# EAGLE design motherboard (EAGLE 5.08)
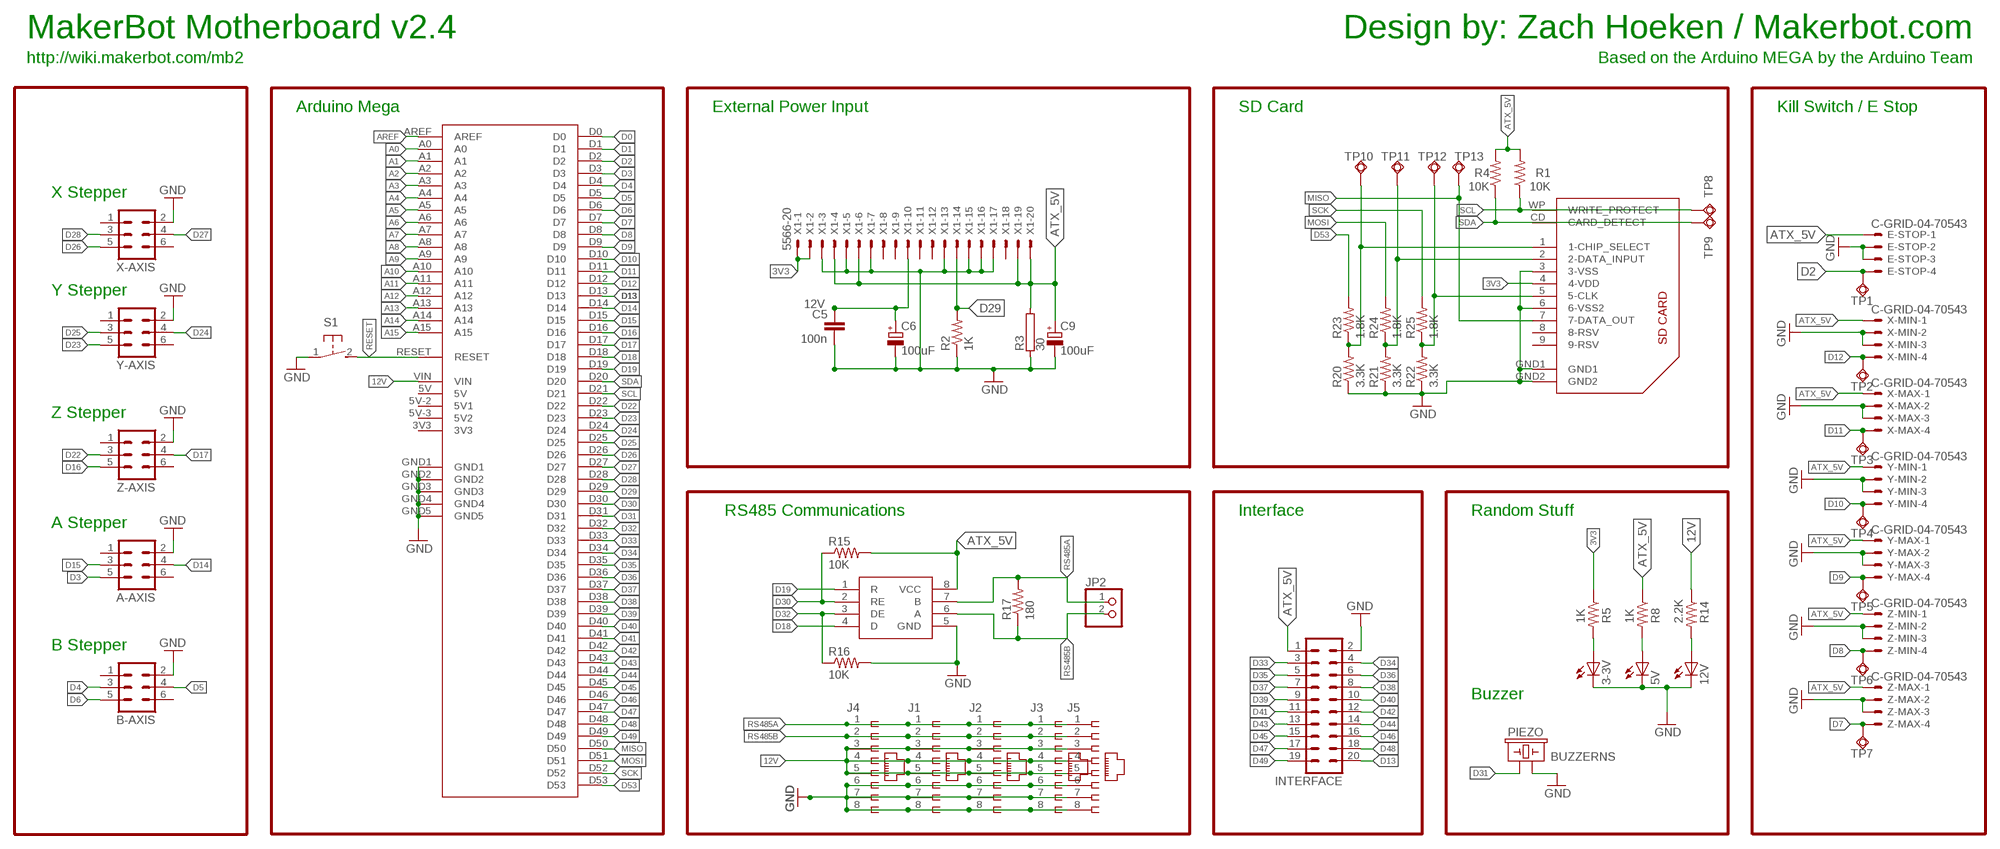
[diagram p0: schematic, sheet 1]

## Parts
3-3V  LED0805  [LED-0805]
5V  LED0805  [LED-0805]
12V  LED0805  [LED-0805]
A-AXIS  ML6  [ML6]
B-AXIS  ML6  [ML6]
C5  100n  CAP0805  [0805]
C6  100uF  CPOL-EUE3.5-8  [E3,5-8]
C9  100uF  CPOL-EUE3.5-8  [E3,5-8]
E-STOP  C-GRID-04-70543  [70543-04]
IC1  SN75176ASOIC  [SO08]
INTERFACE  ML20  [ML20]
J1  556416-1  [556416-1]
J2  556416-1  [556416-1]
J3  556416-1  [556416-1]
J4  556416-1  [556416-1]
J5  556416-1  [556416-1]
JP2  PINHD-1X2  [1X02]
PIEZO  BUZZERNS  [BUZZER-12MM-NS]
R1  10K  RESISTOR  [0805]
R2  1K  RESISTOR  [0805]
R3  30  RKH206-8  [KH206-8]
R4  10K  RESISTOR  [0805]
R5  1K  RESISTOR  [0805]
R8  1K  RESISTOR  [0805]
R14  2.2K  RESISTOR  [0805]
R15  10K  RESISTOR  [0805]
R16  10K  RESISTOR  [0805]
R17  180  RESISTOR  [0805]
R20  3.3K  RESISTOR  [0805]
R21  3.3K  RESISTOR  [0805]
R22  3.3K  RESISTOR  [0805]
R23  1.8K  RESISTOR  [0805]
R24  1.8K  RESISTOR  [0805]
R25  1.8K  RESISTOR  [0805]
S1  31-XX  [B3F-31XX]
TP1  TPSQTP09R  [TP09R]
TP2  TPSQTP09R  [TP09R]
TP3  TPSQTP09R  [TP09R]
TP4  TPSQTP09R  [TP09R]
TP5  TPSQTP09R  [TP09R]
TP6  TPSQTP09R  [TP09R]
TP7  TPSQTP09R  [TP09R]
TP8  TPSQTP09R  [TP09R]
TP9  TPSQTP09R  [TP09R]
TP10  TPSQTP09R  [TP09R]
TP11  TPSQTP09R  [TP09R]
TP12  TPSQTP09R  [TP09R]
TP13  TPSQTP09R  [TP09R]
U$1  ARDUINO-MEGA  [ARDUINO-MEGA]
U$2  SDCARD  [3M-SDCARD]
X1  5566-20  [5566-20]
X-AXIS  ML6  [ML6]
X-MAX  C-GRID-04-70543  [70543-04]
X-MIN  C-GRID-04-70543  [70543-04]
Y-AXIS  ML6  [ML6]
Y-MAX  C-GRID-04-70543  [70543-04]
Y-MIN  C-GRID-04-70543  [70543-04]
Z-AXIS  ML6  [ML6]
Z-MAX  C-GRID-04-70543  [70543-04]
Z-MIN  C-GRID-04-70543  [70543-04]

## Nets
3V3: R5.1 U$2.4(4-VDD) X1.1 X1.2
12V [power]: C5.1 C6.+ J1.3 J1.4 J1.5 J2.3 J2.4 J2.5 J3.3 J3.4 J3.5 J4.3 J4.4 J4.5 J5.3 J5.4 J5.5 R14.1 U$1.VIN X1.10
A0: U$1.A0
A1: U$1.A1
A2: U$1.A2
A3: U$1.A3
A4: U$1.A4
A5: U$1.A5
A6: U$1.A6
A7: U$1.A7
A8: U$1.A8
A9: U$1.A9
A10: U$1.A10
A11: U$1.A11
A12: U$1.A12
A13: U$1.A13
A14: U$1.A14
A15: U$1.A15
AREF: U$1.AREF
ATX_5V [usbvcc]: C9.+ E-STOP.1 IC1.8(VCC) INTERFACE.1 R1.2 R3.2 R4.2 R8.1 R15.2 X1.4 X1.6 X1.19 X1.20 X-MAX.1 X-MIN.1 Y-MAX.1 Y-MIN.1 Z-MAX.1 Z-MIN.1
D0: U$1.D0
D1: U$1.D1
D2: E-STOP.4 TP1.TP U$1.D2
D3: A-AXIS.5 U$1.D3
D4: B-AXIS.3 U$1.D4
D5: B-AXIS.4 U$1.D5
D6: B-AXIS.5 U$1.D6
D7: TP7.TP U$1.D7 Z-MAX.4
D8: TP6.TP U$1.D8 Z-MIN.4
D9: TP5.TP U$1.D9 Y-MAX.4
D10: TP4.TP U$1.D10 Y-MIN.4
D11: TP3.TP U$1.D11 X-MAX.4
D12: TP2.TP U$1.D12 X-MIN.4
D13: INTERFACE.20 U$1.D13
D14: A-AXIS.4 U$1.D14
D15: A-AXIS.3 U$1.D15
D16: U$1.D16 Z-AXIS.5
D17: U$1.D17 Z-AXIS.4
D18: IC1.4(D) U$1.D18
D19: IC1.1(R) U$1.D19
D22: U$1.D22 Z-AXIS.3
D23: U$1.D23 Y-AXIS.5
D24: U$1.D24 Y-AXIS.4
D25: U$1.D25 Y-AXIS.3
D26: U$1.D26 X-AXIS.5
D27: U$1.D27 X-AXIS.4
D28: U$1.D28 X-AXIS.3
D29: R2.2 U$1.D29 X1.14
D30: IC1.2(RE) R15.1 U$1.D30
D31: PIEZO.+ U$1.D31
D32: IC1.3(DE) R16.1 U$1.D32
D33: INTERFACE.3 U$1.D33
D34: INTERFACE.4 U$1.D34
D35: INTERFACE.5 U$1.D35
D36: INTERFACE.6 U$1.D36
D37: INTERFACE.7 U$1.D37
D38: INTERFACE.8 U$1.D38
D39: INTERFACE.9 U$1.D39
D40: INTERFACE.10 U$1.D40
D41: INTERFACE.11 U$1.D41
D42: INTERFACE.12 U$1.D42
D43: INTERFACE.13 U$1.D43
D44: INTERFACE.14 U$1.D44
D45: INTERFACE.15 U$1.D45
D46: INTERFACE.16 U$1.D46
D47: INTERFACE.17 U$1.D47
D48: INTERFACE.18 U$1.D48
D49: INTERFACE.19 U$1.D49
D53: R23.2 U$1.D53
GND [gnd]: 3-3V.C 5V.C 12V.C A-AXIS.2 B-AXIS.2 C5.2 C6.- C9.- E-STOP.2 E-STOP.3 IC1.5(GND) INTERFACE.2 J1.6 J1.7 J1.8 J2.6 J2.7 J2.8 J3.6 J3.7 J3.8 J4.6 J4.7 J4.8 J5.6 J5.7 J5.8 PIEZO.- R2.1 R3.1 R16.2 R20.1 R21.1 R22.1 S1.1(P) U$1.GND1 U$1.GND2 U$1.GND3 U$1.GND4 U$1.GND5 U$2.3(3-VSS) U$2.6(6-VSS2) U$2.GND1 U$2.GND2 X1.3 X1.5 X1.7 X1.13 X1.15 X1.16 X1.17 X-AXIS.2 X-MAX.2 X-MAX.3 X-MIN.2 X-MIN.3 Y-AXIS.2 Y-MAX.2 Y-MAX.3 Y-MIN.2 Y-MIN.3 Z-AXIS.2 Z-MAX.2 Z-MAX.3 Z-MIN.2 Z-MIN.3
MISO: TP13.TP U$1.D50 U$2.7(7-DATA_OUT)
MOSI: R24.2 U$1.D51
N$1: 3-3V.A R5.2
N$3: 5V.A R8.2
N$4: R22.2 R25.1 TP12.TP U$2.5(5-CLK)
N$5: R21.2 R24.1 TP11.TP U$2.2(2-DATA_INPUT)
N$10: 12V.A R14.2
N$11: R20.2 R23.1 TP10.TP U$2.1(1-CHIP_SELECT)
RESET: S1.2(S) U$1.RESET
RS485A: IC1.7(B) J1.1 J2.1 J3.1 J4.1 J5.1 JP2.1 R17.2
RS485B: IC1.6(A) J1.2 J2.2 J3.2 J4.2 J5.2 JP2.2 R17.1
SCK: R25.2 U$1.D52
SCL: R1.1 TP8.TP U$1.D21 U$2.WP(WRITE_PROTECT)
SDA: R4.1 TP9.TP U$1.D20 U$2.CD(CARD_DETECT)
Unconnected: A-AXIS.1 A-AXIS.6 B-AXIS.1 B-AXIS.6 U$1.3V3 U$1.5V U$1.5V-2(5V1) U$1.5V-3(5V2) U$2.8(8-RSV) U$2.9(9-RSV) X1.8 X1.9 X1.11 X1.12 X1.18 X-AXIS.1 X-AXIS.6 Y-AXIS.1 Y-AXIS.6 Z-AXIS.1 Z-AXIS.6

## Notes on the sheet
- Design by: Zach Hoeken / Makerbot.com
- MakerBot Motherboard v2.4
- Based on the Arduino MEGA by the Arduino Team
- http://wiki.makerbot.com/mb2
- Arduino Mega | External Power Input | SD Card | Kill Switch / E Stop
- X Stepper
- Y Stepper
- Z Stepper
- RS485 Communications | Interface | Random Stuff
- A Stepper
- B Stepper
- Buzzer

## Library data of the parts
3-3V 5V 12V = SparkFun:LED: LEDs Standard schematic elements and footprints for 5mm, 3mm, 1206, and 0603 sized LEDs. 5mm - Spark Fun Electronics SKU : COM-00529 (and others)
A-AXIS B-AXIS X-AXIS Y-AXIS Z-AXIS = con-ml:ML6: HARTING
C5 = SparkFun:CAP: Capacitor Standard 0603 ceramic capacitor, and 0.1" leaded capacitor.
C6 C9 = resistor:CPOL-EU: POLARIZED CAPACITOR, European symbol
E-STOP X-MAX X-MIN Y-MAX Y-MIN Z-MAX Z-MIN = con-molex:C-GRID-04: CONNECTOR wire to board 2.54 mm (0.100") pitch header
IC1 = reprap:SN75176A
INTERFACE = con-harting-ml:ML20: HARTING
J1-J5 = con-amp:556416-1: AMP connector
JP2 = pinhead:PINHD-1X2: PIN HEADER
PIEZO = SparkFun:BUZZER: Buzzer 12mm Spark Fun Electronics SKU : Comp-Buzzer
R1 R2 R4 R5 R8 R14-R17 R20-R25 = SparkFun:RESISTOR: Resistor Basic schematic elements and footprints for 0603, 1206, and PTH 1/10th watt (small) resistors.
R3 = resistor-power:R: Power Resitor
S1 = switch-omron:31-XX: OMRON SWITCH
TP1-TP13 = testpad:TPSQ: Test pad
U$1 = MakerBot:ARDUINO-MEGA
U$2 = reprap:SDCARD
X1 = con-molex:5566-20: Mini FIT connector 20 pol ATX PC-Motherboard Power connector Source: http://www.molex.com

## Net classes
0 default: width 0.203 mm, drill 0.406 mm, clearance 0.203 mm
1 power: width 0.61 mm, drill 0.711 mm, clearance 0.203 mm
2 gnd: width 0.305 mm, drill 0.711 mm, clearance 0.203 mm
3 usbvcc: width 0.508 mm, drill 0.711 mm, clearance 0.203 mm

## Board
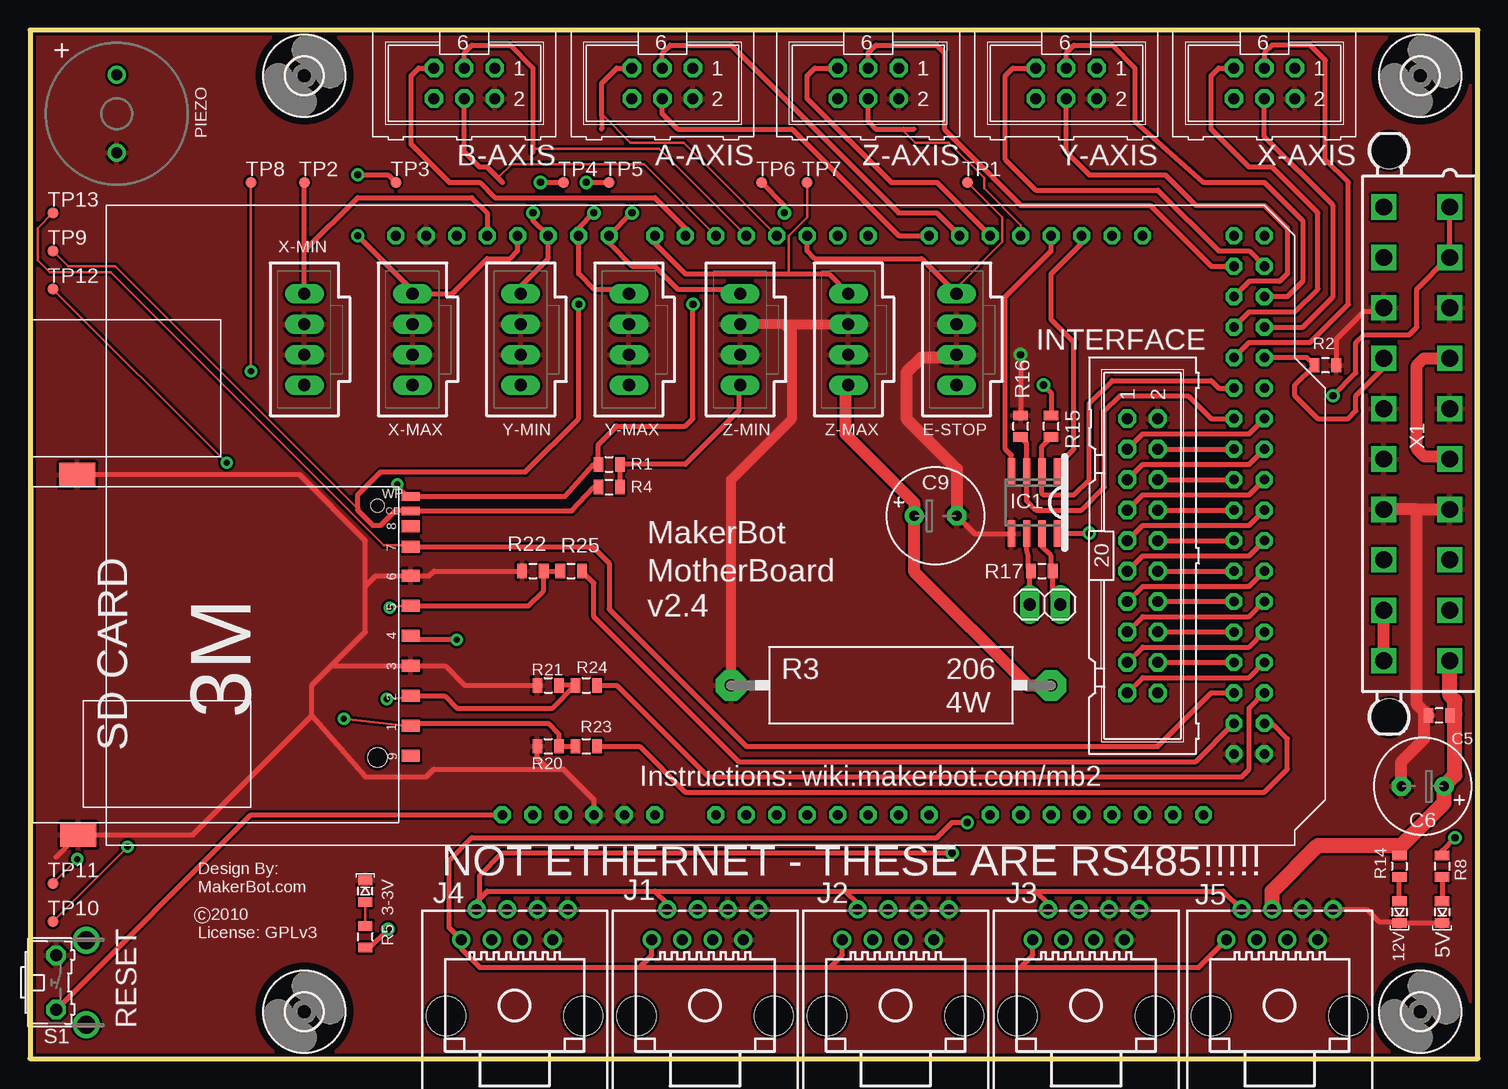
[diagram p1: board, top side]
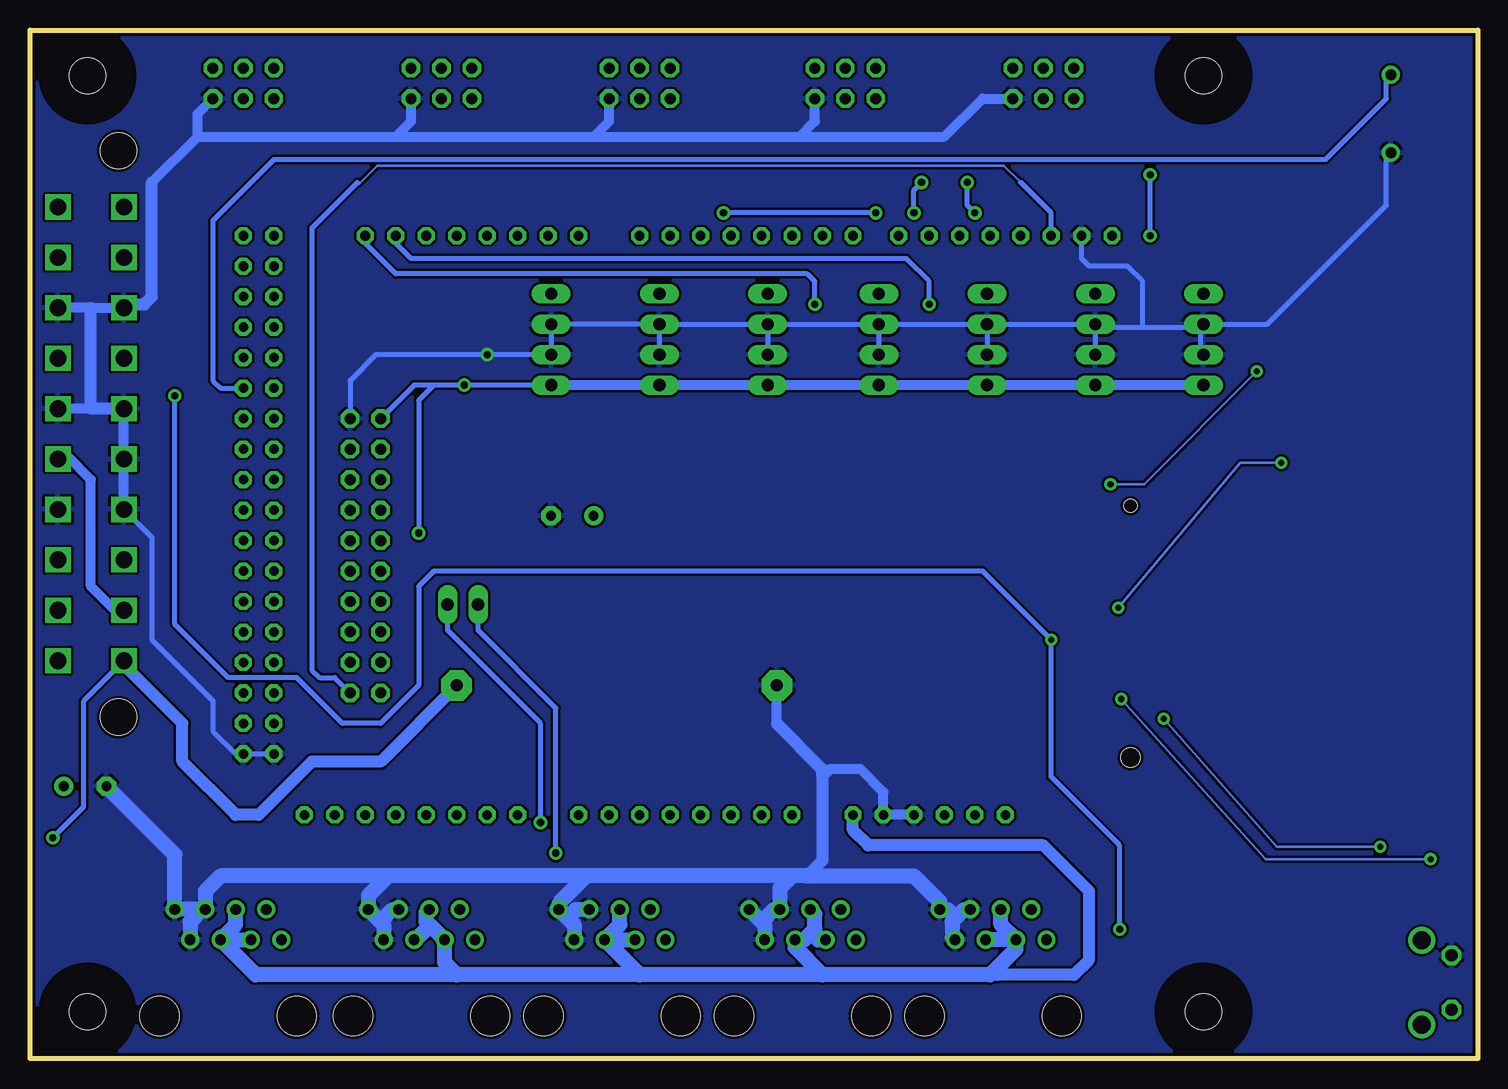
[diagram p2: board, bottom side, seen from below]

Size 120.65 x 85.72 mm. Coordinates in mm from the lower left corner, seen from the top.
Outline: 0,0 120.65,0 120.65,85.72 0,85.72 0,0
Copper layers (1*16): Top 0.035mm / dielectric 1.5mm / Bottom 0.035mm
Design rules "SparkFun": minimum track width 8mil, minimum drill 20mil, track to track 8mil, track to pad 8mil, pad to pad 8mil, via to via 8mil, smd to smd 8mil, copper to edge 10mil, drill to drill 8mil, minimum pad ring 12mil, minimum via ring 10mil, stop-mask expansion 4mil, vias tented up to drill 25mil, thermal gap 10mil

### Footprints (pad centres in the part's own frame; a part is rotated, then mirrored left to right if it is on the bottom)
LED-0805 = smd 1.2 x 0.8: A 0,-0.9; C 0,0.9
ML6 = drill 0.914 octagon: 1 -2.54,-1.27; 2 -2.54,1.27; 3 0,-1.27; 4 0,1.27; 5 2.54,-1.27; 6 2.54,1.27
0805 = smd 0.8 x 1.2: 1 -0.9,0; 2 0.9,0
E3,5-8 = drill 0.813 pad 1.6 round: + -1.778,0 | drill 0.813 pad 1.6 octagon: - 1.778,0
70543-04 = drill 1.016 long: 1 -3.81,0; 2 -1.27,0; 3 1.27,0; 4 3.81,0
SO08 = smd 0.6 x 2.2: 1 -1.905,-2.6; 2 -0.635,-2.6; 3 0.635,-2.6; 4 1.905,-2.6; 5 1.905,2.6; 6 0.635,2.6; 7 -0.635,2.6; 8 -1.905,2.6
ML20 = drill 0.914 octagon: 1 -11.43,-1.27; 2 -11.43,1.27; 3 -8.89,-1.27; 4 -8.89,1.27; 5 -6.35,-1.27; 6 -6.35,1.27; 7 -3.81,-1.27; 8 -3.81,1.27; 9 -1.27,-1.27; 10 -1.27,1.27; 11 1.27,-1.27; 12 1.27,1.27; 13 3.81,-1.27; 14 3.81,1.27; 15 6.35,-1.27; 16 6.35,1.27; 17 8.89,-1.27; 18 8.89,1.27; 19 11.43,-1.27; 20 11.43,1.27
556416-1 = drill 0.889 round: 1 -4.445,5.461; 2 -3.175,8.001; 3 -1.905,5.461; 4 -0.635,8.001; 5 0.635,5.461; 6 1.905,8.001; 7 3.175,5.461; 8 4.445,8.001 | hole 3.251: -5.715,-0.889; 5.715,-0.889
1X02 = drill 1.016 long: 1 -1.27,0; 2 1.27,0
BUZZER-12MM-NS = drill 0.9 round: + 3.25,0; - -3.25,0
KH206-8 = drill 1.016 pad 2.54 octagon: 1 -13.335,0; 2 13.335,0
B3F-31XX = drill 1.016 octagon: 1 -2.261,-1.245; 2 2.261,-1.245 | drill 1.499 pad 2.159 round: 3 -3.505,1.245; 4 3.505,1.245
TP09R = smd 0.9 x 0.9: TP 0,0
ARDUINO-MEGA = drill 0.8 octagon: 3V3 35.56,2.54; 5V 93.98,50.8; 5V-2 96.52,50.8; 5V-3 38.1,2.54; A0 50.8,2.54; A1 53.34,2.54; A2 55.88,2.54; A3 58.42,2.54; A4 60.96,2.54; A5 63.5,2.54; A6 66.04,2.54; A7 68.58,2.54; A8 73.66,2.54; A9 76.2,2.54; A10 78.74,2.54; A11 81.28,2.54; A12 83.82,2.54; A13 86.36,2.54; A14 88.9,2.54; A15 91.44,2.54; AREF 24.13,50.8; D0 63.5,50.8; D1 60.96,50.8; D2 58.42,50.8; D3 55.88,50.8; D4 53.34,50.8; D5 50.8,50.8; D6 48.26,50.8; D7 45.72,50.8; D8 41.91,50.8; D9 39.37,50.8; D10 36.83,50.8; D11 34.29,50.8; D12 31.75,50.8; D13 29.21,50.8; D14 68.58,50.8; D15 71.12,50.8; D16 73.66,50.8; D17 76.2,50.8; D18 78.74,50.8; D19 81.28,50.8; D20 83.82,50.8; D21 86.36,50.8; D22 93.98,48.26; D23 96.52,48.26; D24 93.98,45.72; D25 96.52,45.72; D26 93.98,43.18; D27 96.52,43.18; D28 93.98,40.64; D29 96.52,40.64; D30 93.98,38.1; D31 96.52,38.1; D32 93.98,35.56; D33 96.52,35.56; D34 93.98,33.02; D35 96.52,33.02; D36 93.98,30.48; D37 96.52,30.48; D38 93.98,27.94; D39 96.52,27.94; D40 93.98,25.4; D41 96.52,25.4; D42 93.98,22.86; D43 96.52,22.86; D44 93.98,20.32; D45 96.52,20.32; D46 93.98,17.78; D47 96.52,17.78; D48 93.98,15.24; D49 96.52,15.24; D50 93.98,12.7; D51 96.52,12.7; D52 93.98,10.16; D53 96.52,10.16; GND1 26.67,50.8; GND2 93.98,7.62; GND3 96.52,7.62; GND4 40.64,2.54; GND5 43.18,2.54; RESET 33.02,2.54; VIN 45.72,2.54
3M-SDCARD = smd 1 x 1.5: 1 5.93,16.5; 2 3.43,16.5; 3 0.93,16.5; 4 -1.57,16.5; 5 -4.07,16.5; 6 -6.57,16.5; 7 -9,16.5; 8 -10.7,16.5; 9 8.43,16.5 | smd 0.7 x 1.5: CD -12,16.5; WP -13.2,16.5 | smd 2 x 3: GND1 -15,-11.3; GND2 15,-11.2 | hole 1.1: -12.427,13.705 | hole 1.6: 8.567,13.708
3,0 = hole 3: 0,0
5566-20 = drill 1.4 square: 1 18.9,-2.75; 2 14.7,-2.75; 3 10.5,-2.75; 4 6.3,-2.75; 5 2.1,-2.75; 6 -2.1,-2.75; 7 -6.3,-2.75; 8 -10.5,-2.75; 9 -14.7,-2.75; 10 -18.9,-2.75; 11 18.9,2.75; 12 14.7,2.75; 13 10.5,2.75; 14 6.3,2.75; 15 2.1,2.75; 16 -2.1,2.75; 17 -6.3,2.75; 18 -10.5,2.75; 19 -14.7,2.75; 20 -18.9,2.75 | hole 3: 23.6,2.29; -23.6,2.29

### Placement (x,y rotation side)
3-3V  27.94,13.97 0 top
5V  117.68,12.22 180 top
12V  114.12,12.22 180 top
A-AXIS  52.7,81.28 180 top
B-AXIS  36.2,81.28 180 top
C5  117.43,28.6 180 top
C6  116.06,22.7 180 top
C9  75.46,45.24 0 top
E-STOP  77.22,59.94 90 top
IC1  83.69,46.35 180 top
INTERFACE  92.71,41.91 270 top
J1  56.26,4.45 0 top
J2  72.14,4.45 0 top
J3  88.01,4.45 0 top
J4  40.39,4.45 0 top
J5  104.14,4.45 0 top
JP2  84.58,37.85 180 top
PIEZO  7.24,78.74 90 top
R1  48.26,49.53 0 top
R2  107.95,57.78 180 top
R3  71.75,31.11 0 top
R4  48.26,47.62 0 top
R5  27.94,10.16 90 top
R8  117.68,16.03 270 top
R14  114.12,16.03 270 top
R15  85.09,52.7 90 top
R16  82.55,52.7 90 top
R17  84.33,40.64 0 top
R20  43.18,26.04 0 top
R21  43.18,31.11 0 top
R22  41.91,40.64 0 top
R23  46.36,26.04 0 top
R24  46.36,31.11 0 top
R25  45.09,40.64 0 top
S1  3.43,6.35 270 top
TP1  78.11,73.03 0 top
TP2  22.86,73.03 0 top
TP3  30.48,73.03 0 top
TP4  44.45,73.03 0 top
TP5  48.26,73.03 0 top
TP6  60.96,73.03 0 top
TP7  64.77,73.03 0 top
TP8  18.41,73.03 0 top
TP9  1.91,67.31 0 top
TP10  1.91,11.43 0 top
TP11  1.91,14.61 0 top
TP12  1.91,64.14 0 top
TP13  1.91,70.48 0 top
U$1  6.35,17.78 0 top
U$2  15.24,33.66 270 top
U$4  [3,0]  22.86,81.92 0 top
U$5  [3,0]  115.86,81.92 0 top
U$6  [3,0]  115.86,3.92 0 top
U$7  [3,0]  22.86,3.92 0 top
X1  115.57,52.07 90 top
X-AXIS  102.87,81.28 180 top
X-MAX  31.88,59.94 90 top
X-MIN  22.86,59.94 90 top
Y-AXIS  86.36,81.28 180 top
Y-MAX  49.91,59.94 90 top
Y-MIN  40.89,59.94 90 top
Z-AXIS  69.85,81.28 180 top
Z-MAX  68.2,59.94 90 top
Z-MIN  59.18,59.94 90 top

### Tracks (layer width: path | path; a pad name or v marks a point on that pad's centre or on a via)
3V3  (via drill 0.5, 0.6)
  Top 0.203: R5.1 27.94,9.27
  Top 0.406: v35.56,34.92 32.04,34.92 U$2.4 | X1.1 X1.2 118.2,66.77 115.57,64.14 115.57,60.96 114.94,60.33 111.12,60.33 110.49,59.69 110.49,57.15 v108.58,55.24 | 27.94,9.27 28.32,9.27 v29.84,10.79
  Bottom 0.406: v108.58,55.24 108.58,36.2 104.14,31.75 98.42,31.75 94.61,27.94 91.44,27.94 88.27,31.11 88.27,39.37 86.99,40.64 41.28,40.64 v35.56,34.92 35.56,23.5 29.84,17.78 v29.84,10.79
12V
  Top 0.61: R14.1 114.17,17.02 114.17,17.78 | C5.1 118.36,28.7 118.74,28.7
  Top 1.27: X1.10 118.32,30.27 118.74,29.84 118.74,28.7 118.74,23.61 C6.+ 117.84,21.32 114.3,17.78 114.17,17.78 107.31,17.78 103.5,13.97 J5.4
  Bottom 1.016: U$1.VIN 52.07,19.05 50.8,17.78 36.2,17.78 32.39,13.97 32.39,8.26 33.66,6.99 40,6.99 40.32,7.3
  Bottom 1.27: J4.3 38.48,9.14 40.32,7.3 40.64,6.99 54.61,6.99 | 54.61,6.99 69.85,6.99 | 69.85,6.99 85.09,6.99 | 85.09,6.99 101.85,6.99 J5.5 | J5.5 J5.3 | J5.5 104.77,10.16 | 87.31,11.11 J3.3 86.11,8 85.09,6.99 | 87.31,11.11 87.63,11.43 87.63,12.19 J3.4 | J3.5 88.52,9.91 87.31,11.11 | J2.4 71.5,11.18 J2.5 | J2.5 J2.3 | 69.85,6.99 J2.5 | 55.56,10.48 56.13,9.91 J1.5 56.9,9.27 54.61,6.99 | 55.56,10.48 55.25,10.79 55.25,12.06 J1.4 | J1.3 54.99,9.91 55.56,10.48 | J4.4 39.75,11.18 J4.3 | J4.3 J4.5 | J5.4 103.5,11.18 J5.5
ATX_5V  (via drill 0.6)
  Top 0.406: R4.2 R1.2 54.61,49.53 59.06,53.98 59.06,56.01 Z-MIN.1 | R15.2 85.09,55.5 v84.45,56.13 | R8.1 117.68,17.35 v118.74,18.41 | IC1.8 88.2,43.76 v88.27,43.81
  Top 1.016: X1.20 X1.19 | R3.2 83.19,31.11 73.66,40.64 73.66,45.22 C9.+ 73.68,46.33 67.95,52.07 67.95,55.88 Z-MAX.1 | X1.4 116.16,58.37 115.57,57.78 115.57,50.8 116.2,50.16 118.12,50.16 X1.6
  Bottom 0.406: 86.99,56.13 v84.45,56.13 E-STOP.1 | 86.99,56.13 88.65,56.13 INTERFACE.1 | v118.74,18.41 116.2,20.95 116.2,29.79 X1.20 | v88.27,43.81 88.27,54.86 86.99,56.13
  Bottom 0.813: X-MIN.1 X-MAX.1 Y-MIN.1 Y-MAX.1 Z-MIN.1 Z-MAX.1 E-STOP.1 | X1.19 113.57,37.37 115.57,39.37 115.57,48.26 117.47,50.16 118.12,50.16 X1.6
  Bottom 1.016: X1.20 112.82,32.81 107.95,27.94 107.95,24.77 103.5,20.32 101.6,20.32 97.16,24.77 91.44,24.77 R3.2
D2
  Top 0.203: TP1.TP 81.03,70.1 81.03,68.07 77.09,64.14 E-STOP.4
  Top 0.406: U$1.D2 64.77,67.31 65.41,66.67 74.3,66.67 E-STOP.4
D3
  Top 0.203: U$1.D3 54.48,76.33 50.04,76.33 47.75,78.61 47.62,78.61
  Top 0.406: 47.62,77.47 47.62,78.61 47.62,81.28 48.89,82.55 A-AXIS.5
D4
  Top 0.203: U$1.D4 52.45,75.82 41.91,75.82
  Top 0.406: 41.91,75.56 41.91,75.82 41.91,82.55 40,84.45 36.83,84.45 36.2,83.82 B-AXIS.3
D5
  Top 0.203: U$1.D5 51.18,74.55 40.13,74.55 38.99,73.41
  Top 0.406: 39.37,73.03 38.99,73.41 38.1,74.3 37.47,74.3 36.2,75.56 B-AXIS.4
D6
  Top 0.406: U$1.D6 54.61,69.22 52.07,71.75 38.73,71.75 37.47,73.03 34.92,73.03 31.75,76.2 31.75,81.92 32.39,82.55 B-AXIS.5
D7
  Top 0.203: TP7.TP 64.77,70.1 63.25,68.58 63.25,65.41
  Top 0.406: U$1.D7 52.07,67.94 54.61,65.41 63.25,65.41 66.55,65.41 Z-MAX.4
D8  (via drill 0.6)
  Top 0.406: Z-MIN.4 58.8,64.14 53.97,64.14 52.07,66.04 50.16,66.04 48.26,67.94 U$1.D8 v50.16,70.48 | v62.86,70.48 62.86,71.12 TP6.TP
  Bottom 0.406: v50.16,70.48 v62.86,70.48
D9  (via drill 0.6)
  Top 0.406: Y-MAX.4 49.53,64.14 46.99,64.14 45.72,65.41 U$1.D9 45.72,69.22 v46.99,70.48 | v46.36,73.03 TP5.TP
  Bottom 0.406: v46.99,70.48 46.99,72.39 v46.36,73.03
D10  (via drill 0.6)
  Top 0.406: Y-MIN.4 40.89,64.39 43.18,66.67 U$1.D10 41.91,69.85 v41.91,70.48 | v42.55,73.03 TP4.TP
  Bottom 0.406: v42.55,73.03 42.55,71.12 v41.91,70.48
D11  (via drill 0.6)
  Top 0.406: U$1.D11 40.64,67.31 40,66.67 38.1,66.67 35.18,63.75 X-MAX.4 31.88,64.01 v27.3,68.58 | v27.3,73.66 29.84,73.66 TP3.TP
  Bottom 0.406: v27.3,68.58 v27.3,73.66
D12
  Top 0.406: U$1.D12 38.1,70.48 36.83,71.75 27.3,71.75 22.86,67.31 X-MIN.4 TP2.TP
D13
  Bottom 0.203: 38.1,73.03 39.5,74.42 91.69,74.42 93.22,72.9 93.34,73.03
  Bottom 0.406: U$1.D13 35.56,70.48 38.1,73.03 | INTERFACE.20 95.25,31.75 96.52,31.75 97.16,32.38 97.16,69.22 93.34,73.03
D14
  Top 0.406: U$1.D14 72.39,68.58 63.5,77.47 53.97,77.47 52.7,78.74 A-AXIS.4
D15
  Top 0.406: U$1.D15 75.56,70.48 72.39,70.48 58.42,84.45 53.34,84.45 52.7,83.82 A-AXIS.3
D16
  Top 0.406: U$1.D16 75.56,73.03 71.75,73.03 64.77,80.01 64.77,81.92 65.41,82.55 Z-AXIS.5
D17
  Top 0.203: U$1.D17 82.55,69.47 79.5,72.52 79.5,73.41 76.58,76.33 73.79,76.33 72.77,77.34 72.77,77.47
  Top 0.406: 73.66,77.47 72.77,77.47 70.48,77.47 69.85,78.11 Z-AXIS.4
D18
  Top 0.406: U$1.D18 85.09,67.31 81.28,63.5 81.28,50.8 81.79,50.29 IC1.4
D19
  Top 0.406: U$1.D19 87.63,67.94 85.09,65.41 85.09,61.59 86.99,59.69 86.99,50.8 85.6,49.4 IC1.1
D22
  Top 0.406: U$1.D22 98.42,66.04 93.34,71.12 82.55,71.12 76.2,77.47 76.2,83.82 75.56,84.45 70.48,84.45 69.85,83.82 Z-AXIS.3
D23
  Top 0.406: Y-AXIS.5 81.92,82.55 81.28,81.92 81.28,74.93 83.82,72.39 93.98,72.39 99.06,67.31 101.6,67.31 U$1.D23
D24
  Top 0.406: U$1.D24 101.6,64.77 104.14,64.77 104.77,65.41 104.77,69.22 102.87,71.12 97.16,71.12 94.61,73.66 88.27,73.66 86.36,75.56 Y-AXIS.4
D25
  Top 0.406: U$1.D25 104.77,63.5 106.05,64.77 106.05,69.85 102.87,73.03 97.79,73.03 92.08,78.11 92.08,82.55 90.17,84.45 86.99,84.45 86.36,83.82 Y-AXIS.3
D26
  Top 0.406: U$1.D26 101.6,62.23 105.41,62.23 107.31,64.14 107.31,70.48 103.5,74.3 101.6,74.3 98.42,77.47 98.42,81.92 99.06,82.55 X-AXIS.5
D27
  Top 0.406: U$1.D27 106.05,60.96 108.58,63.5 108.58,71.12 102.87,76.83 X-AXIS.4
D28
  Top 0.406: U$1.D28 101.6,59.69 106.68,59.69 109.86,62.87 109.86,73.03 107.95,74.93 107.95,83.19 106.68,84.45 103.5,84.45 102.87,83.82 X-AXIS.3
D29
  Top 0.406: U$1.D29 106.41,58.42 R2.2 105.41,56.15 105.41,55.24 107.31,53.34 109.86,53.34 110.49,53.98 110.49,55.24 112.82,57.58 X1.14
D30
  Top 0.406: U$1.D30 99.06,55.88 98.42,56.52 90.17,56.52 88.27,54.61 88.27,48.26 86.99,46.99 84.45,46.99 84.33,47.12 IC1.2 84.33,51.04 R15.1
D31
  Bottom 0.406: U$1.D31 104.77,55.88 105.41,56.52 105.41,69.85 100.33,74.93 12.7,74.93 7.62,80.01 7.62,81.61 PIEZO.+
D32
  Top 0.406: U$1.D32 98.42,53.34 96.52,55.24 90.8,55.24 89.53,53.98 89.53,47.62 87.63,45.72 83.82,45.72 83.06,46.48 IC1.3 83.06,51.3 R16.1
D33
  Top 0.406: INTERFACE.3 92.71,52.07 101.6,52.07 U$1.D33
D34
  Top 0.406: INTERFACE.4 U$1.D34
D35
  Top 0.406: INTERFACE.5 92.71,49.53 101.6,49.53 U$1.D35
D36
  Top 0.406: INTERFACE.6 U$1.D36
D37
  Top 0.406: INTERFACE.7 92.71,46.99 101.6,46.99 U$1.D37
D38
  Top 0.406: INTERFACE.8 U$1.D38
D39
  Top 0.406: INTERFACE.9 92.71,44.45 101.6,44.45 U$1.D39
D40
  Top 0.406: INTERFACE.10 U$1.D40
D41
  Top 0.406: INTERFACE.11 92.71,41.91 101.6,41.91 U$1.D41
D42
  Top 0.406: INTERFACE.12 U$1.D42
D43
  Top 0.406: INTERFACE.13 92.71,39.37 101.6,39.37 U$1.D43
D44
  Top 0.406: INTERFACE.14 U$1.D44
D45
  Top 0.406: INTERFACE.15 92.71,36.83 101.6,36.83 U$1.D45
D46
  Top 0.406: INTERFACE.16 U$1.D46
D47
  Top 0.406: INTERFACE.17 92.71,34.29 101.6,34.29 U$1.D47
D48
  Top 0.406: INTERFACE.18 U$1.D48
D49
  Top 0.406: INTERFACE.19 92.71,31.75 101.6,31.75 U$1.D49
D53
  Top 0.406: U$1.D53 103.5,27.94 104.77,26.67 104.77,24.13 102.87,22.23 54.61,22.23 50.8,26.04 R23.2
GND  (via drill 0.6)
  Top 0.406: 2.18,16.8 U$2.GND2 13.58,18.66 23.5,28.57 | v82.55,58.67 R16.2 | 5V.C 12V.C 114.01,11.43 112.39,11.43 111.38,12.45 J5.8 | IC1.5 78.73,43.76 C9.- | 25.11,32.73 27.94,35.56 27.94,39.37 | 23.5,28.57 23.5,31.11 25.11,32.73 | 27.94,39.37 27.94,43.18 22.46,48.66 U$2.GND1 | 23.5,28.57 27.94,23.5 33.02,23.5 33.66,24.13 43.18,24.13 | R22.1 33.66,40.64 33.24,40.23 U$2.6 28.8,40.23 27.94,39.37 | 25.11,32.73 U$2.3 34.59,32.73 36.2,31.11 R21.1 | U$1.GND4 46.99,21.59 44.45,24.13 43.18,24.13 | R20.1 42.28,25.03 43.18,24.13 | R2.1 108.85,59.95 111.12,62.23 112.48,62.23 X1.13
  Top 0.813: R3.1 58.42,48.26 63.5,53.34 63.5,60.58 62.86,61.21 | 62.86,61.21 58.42,61.21 | 62.86,61.21 Z-MAX.3
  Top 1.016: C9.- 77.24,49.13 73.03,53.34 73.03,57.15 74.3,58.42 76.96,58.42 E-STOP.2 | Z-MIN.2 59.44,58.42 | 115.57,45.72 115.57,29.56 116.2,28.92 | 116.2,28.92 C5.2 | C6.- 114.28,24.75 116.2,26.67 116.2,28.92 | X1.17 115.52,45.77 115.57,45.72 | X1.7 115.62,45.77 115.57,45.72
  Bottom 0.406: X-AXIS.2 105.22,80.01 | U$1.GND1 33.02,66.67 32.39,66.04 29.21,66.04 27.94,64.77 27.94,60.96 | 27.94,60.96 23.11,60.96 | 23.11,60.96 X-MIN.3 17.53,61.21 7.62,71.12 7.62,75.11 PIEZO.- | 27.94,60.96 31.62,60.96 X-MAX.3 32.39,61.21 | Y-MIN.3 32.39,61.21 | Y-MAX.3 Y-MIN.3 | Z-MIN.3 Y-MAX.3 | Z-MAX.3 Z-MIN.3 | Z-MAX.3 E-STOP.3 E-STOP.2 v82.55,58.67 91.82,58.67 93.98,56.52 INTERFACE.2 | 23.11,60.96 23.11,58.93 X-MIN.2 | X-MAX.2 31.88,60.71 32.39,61.21 | Y-MIN.3 Y-MIN.2 | Y-MAX.3 Y-MAX.2 | Z-MIN.3 Z-MIN.2 | Z-MAX.3 Z-MAX.2 | U$1.GND2 U$1.GND3 103.5,25.4 105.41,27.3 105.41,29.84 110.49,34.92 110.49,43.44 X1.17
  Bottom 0.813: X1.17 X1.16 X1.15 X1.5 | X1.13 115.57,62.57 X1.3 | B-AXIS.2 41.28,80.01 44.45,76.83 56.52,76.83 | 73.66,76.83 56.52,76.83 | 90.17,76.83 73.66,76.83 | 106.68,76.83 90.17,76.83 | 110.49,73.03 106.68,76.83 | 106.68,76.83 106.68,78.74 X-AXIS.2 | Y-AXIS.2 88.9,78.11 90.17,76.83 | Z-AXIS.2 72.39,78.11 73.66,76.83 | A-AXIS.2 55.25,78.11 56.52,76.83 | 54.61,23.5 53.97,24.13 51.44,24.13 49.53,22.23 U$1.GND5 U$1.GND4 | 58.42,27.94 R3.1
  Bottom 1.016: X1.15 115.57,54.17 115.57,62.57 | 110.49,73.03 110.49,63.5 111.12,62.87 112.52,62.87 X1.13 | 58.42,27.94 54.61,24.13 54.61,23.5 54.61,16.51 55.88,15.24
  Bottom 1.27: J4.6 42.8,12.45 43.5,11.75 | 43.5,11.75 43.81,11.43 43.81,10.16 J4.7 | 43.5,11.75 44.2,12.45 J4.8 44.83,13.08 46.99,15.24 55.88,15.24 57.15,15.24 | 57.15,15.24 74.3,15.24 | 74.3,15.24 90.8,15.24 | 90.8,15.24 104.77,15.24 106.05,13.97 J5.6 | J5.6 106.3,12.45 107.31,11.43 J5.7 | J5.6 J5.8 108.58,17 C6.- | J3.7 91.19,11.18 91.44,11.43 | 91.44,11.43 J3.8 92.46,13.59 90.8,15.24 | J3.6 90.42,12.45 91.44,11.43 | J2.7 75.31,11.18 75.56,11.43 | 75.56,11.43 J2.8 76.58,12.95 74.3,15.24 | J2.6 75.18,12.45 75.56,12.06 75.56,11.43 | J1.7 59.44,11.18 59.69,11.43 | 59.69,11.43 J1.8 | 59.69,11.43 58.67,12.45 J1.6 58.17,14.22 57.15,15.24
  pour Top: -1.27,86.36 120.65,86.36 120.65,0 -1.27,0
  pour Bottom: -1.27,86.36 120.65,86.36 120.65,0 -1.27,0
MISO
  Top 0.203: TP13.TP 0.64,69.22 0.64,66.55 1.65,65.53 6.73,65.53 29.46,42.8 31.62,42.8 U$2.7
  Top 0.406: U$2.7 46.88,42.66 48.26,41.27 48.26,37.47 59.69,26.04 93.98,26.04 98.42,30.48 U$1.D50
MOSI
  Top 0.406: 47.62,31.11 R24.2 48.89,31.11 56.52,23.5 100.97,23.5 101.6,24.13 101.6,29.21 U$1.D51
N$1
  Top 0.203: R5.2 3-3V.A
N$3
  Top 0.406: R8.2 5V.A
N$4  (via drill 0.51)
  Top 0.203: v16.38,49.66 TP12.TP | v29.97,37.59 31.62,37.85 U$2.5
  Top 0.406: R25.1 R22.2 42.81,39 41.53,37.73 U$2.5
  Bottom 0.203: v16.38,49.66 19.81,49.66 v29.97,37.59
N$5  (via drill 0.51)
  Top 0.203: TP11.TP v3.94,16.64 | v29.72,29.97 31.12,30.1 31.62,30.1 U$2.2
  Top 0.406: R21.2 R24.1 43.55,29.21 35.56,29.21 34.55,30.23 U$2.2
  Bottom 0.203: v3.94,16.64 17.65,16.64 v29.72,29.97
N$10
  Top 0.406: 12V.A R14.2
N$11  (via drill 0.51)
  Top 0.203: TP10.TP v8.13,17.65 | v26.16,28.32 31.62,27.69 U$2.1
  Top 0.406: R23.1 R20.2 44.08,27.04 43.18,27.94 31.95,27.94 U$2.1
  Bottom 0.203: v8.13,17.65 16.76,17.65 v26.16,28.32
RESET
  Top 0.406: U$1.RESET 18.41,20.32 S1.2
RS485A  (via drill 0.6)
  Top 0.406: IC1.7 84.33,42.67 85.09,41.91 85.09,40.78 R17.2 85.23,38.47 JP2.1 | 50.8,7.62 37.47,7.62 35.94,9.14 J4.1 34.92,10.92 34.92,16.51 36.83,18.41 75.56,18.41 76.83,19.68 v78.11,19.68 | 50.8,7.62 66.67,7.62 | 66.67,7.62 82.55,7.62 | 82.55,7.62 97.41,7.62 J5.1 | J3.1 83.57,8.64 82.55,7.62 | J2.1 67.69,8.64 66.67,7.62 | J1.1 51.82,8.64 50.8,7.62
  Bottom 0.406: JP2.1 85.85,35.69 78.11,27.94 v78.11,19.68
RS485B  (via drill 0.6)
  Top 0.406: IC1.6 83.06,42.42 83.19,41.91 83.19,40.88 R17.1 83.31,40.52 JP2.2 | 52.07,13.97 38.1,13.97 37.21,13.08 J4.2 37.47,12.7 37.47,15.24 39.37,17.14 v76.83,17.14 | 52.07,13.97 67.95,13.97 | 67.95,13.97 83.82,13.97 | 83.82,13.97 99.44,13.97 J5.2 | J3.2 84.84,12.95 83.82,13.97 | J2.2 68.96,12.95 67.95,13.97 | J1.2 53.09,12.95 52.07,13.97
  Bottom 0.406: JP2.2 83.31,35.69 76.83,29.21 v76.83,17.14
SCK
  Top 0.406: U$1.D52 97.16,24.77 59.06,24.77 46.99,36.83 46.99,39.63 R25.2
SCL  (via drill 0.51, 0.6)
  Top 0.203: v18.41,57.28 TP8.TP | v30.61,47.88 31.62,46.86 U$2.WP
  Top 0.406: R1.1 47.23,49.4 | v55.25,62.87 55.25,53.34 54.61,52.7 48.89,52.7 47.36,51.17 R1.1 | U$2.WP 44.59,46.85 46.99,49.53 R1.1
  Bottom 0.203: v18.41,57.28 27.81,47.88 v30.61,47.88
  Bottom 0.406: U$1.D21 92.71,67.94 90.17,65.41 55.88,65.41 55.25,64.77 v55.25,62.87
SDA  (via drill 0.6)
  Top 0.203: TP9.TP 3.18,66.04 7.11,66.04 27.18,45.97 27.3,45.97
  Top 0.406: v45.72,62.87 45.72,53.34 41.28,48.9 29.21,48.9 27.3,46.99 27.3,45.97 27.3,45.72 28.58,44.45 29.21,44.45 30.48,45.72 31.04,45.72 U$2.CD 45.15,45.66 46.99,47.62 R4.1
  Bottom 0.406: U$1.D20 90.17,67.94 88.9,66.67 47.62,66.67 45.72,64.77 v45.72,62.87

### Text on the board
tPlace: PIEZO | MakerBot | MotherBoard | v2.4 | Instructions: wiki.makerbot.com/mb2 | Design By: | NOT ETHERNET - THESE ARE RS485!!!!! | MakerBot.com | c 2010 | License: GPLv3 | RESET
_tsilk: +